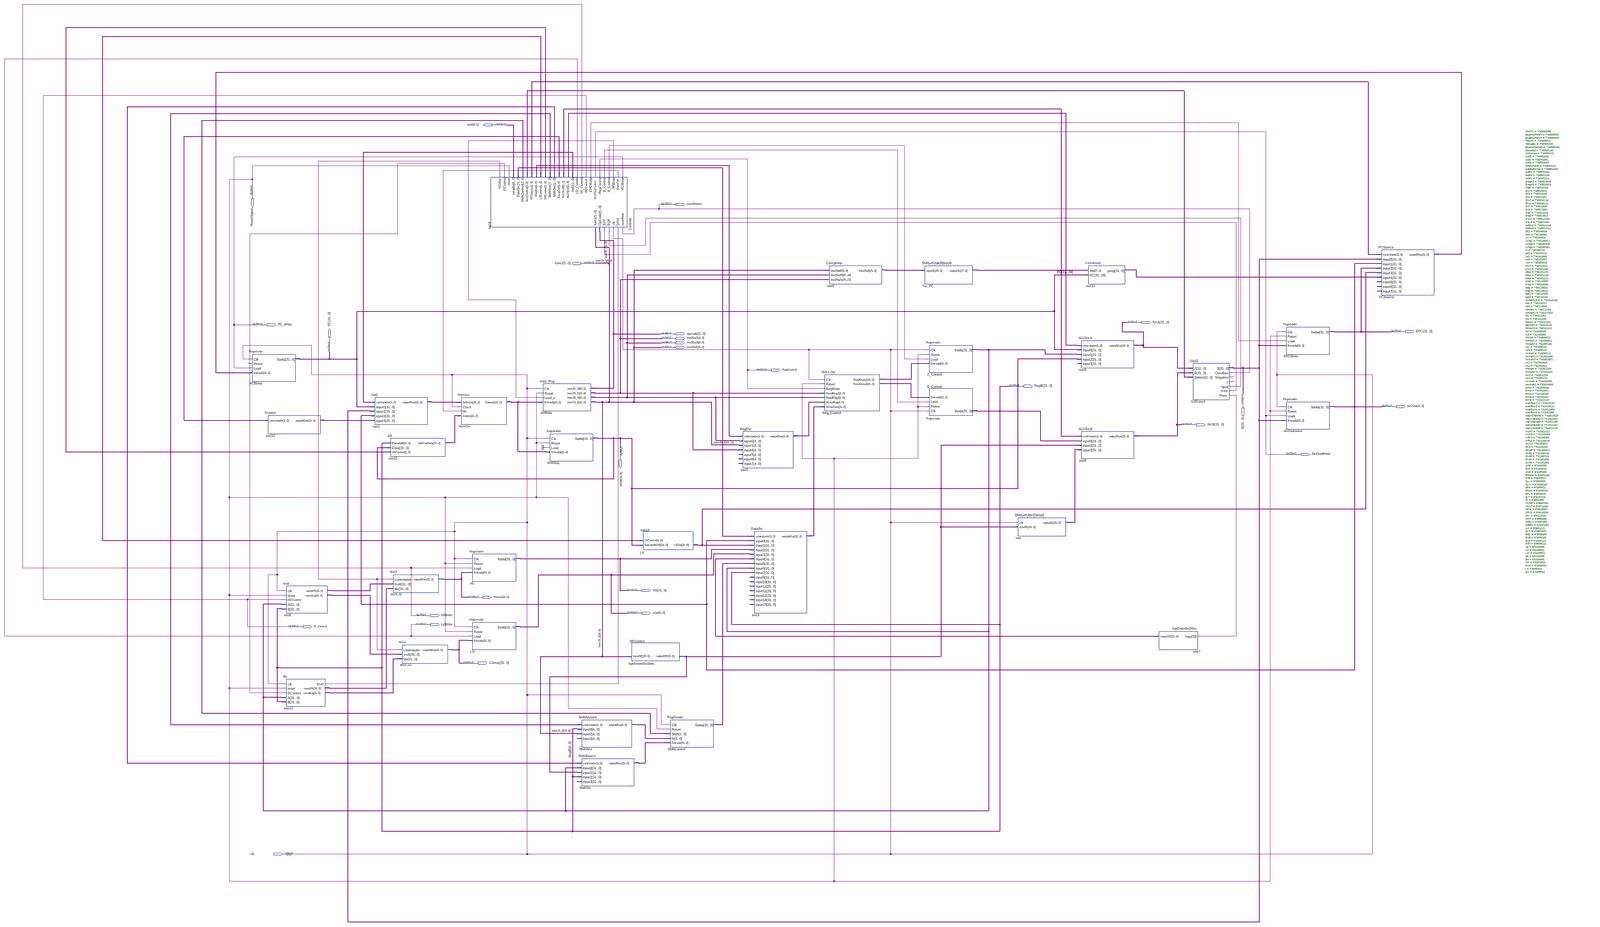
[diagram p0: schematic sheet, whole]
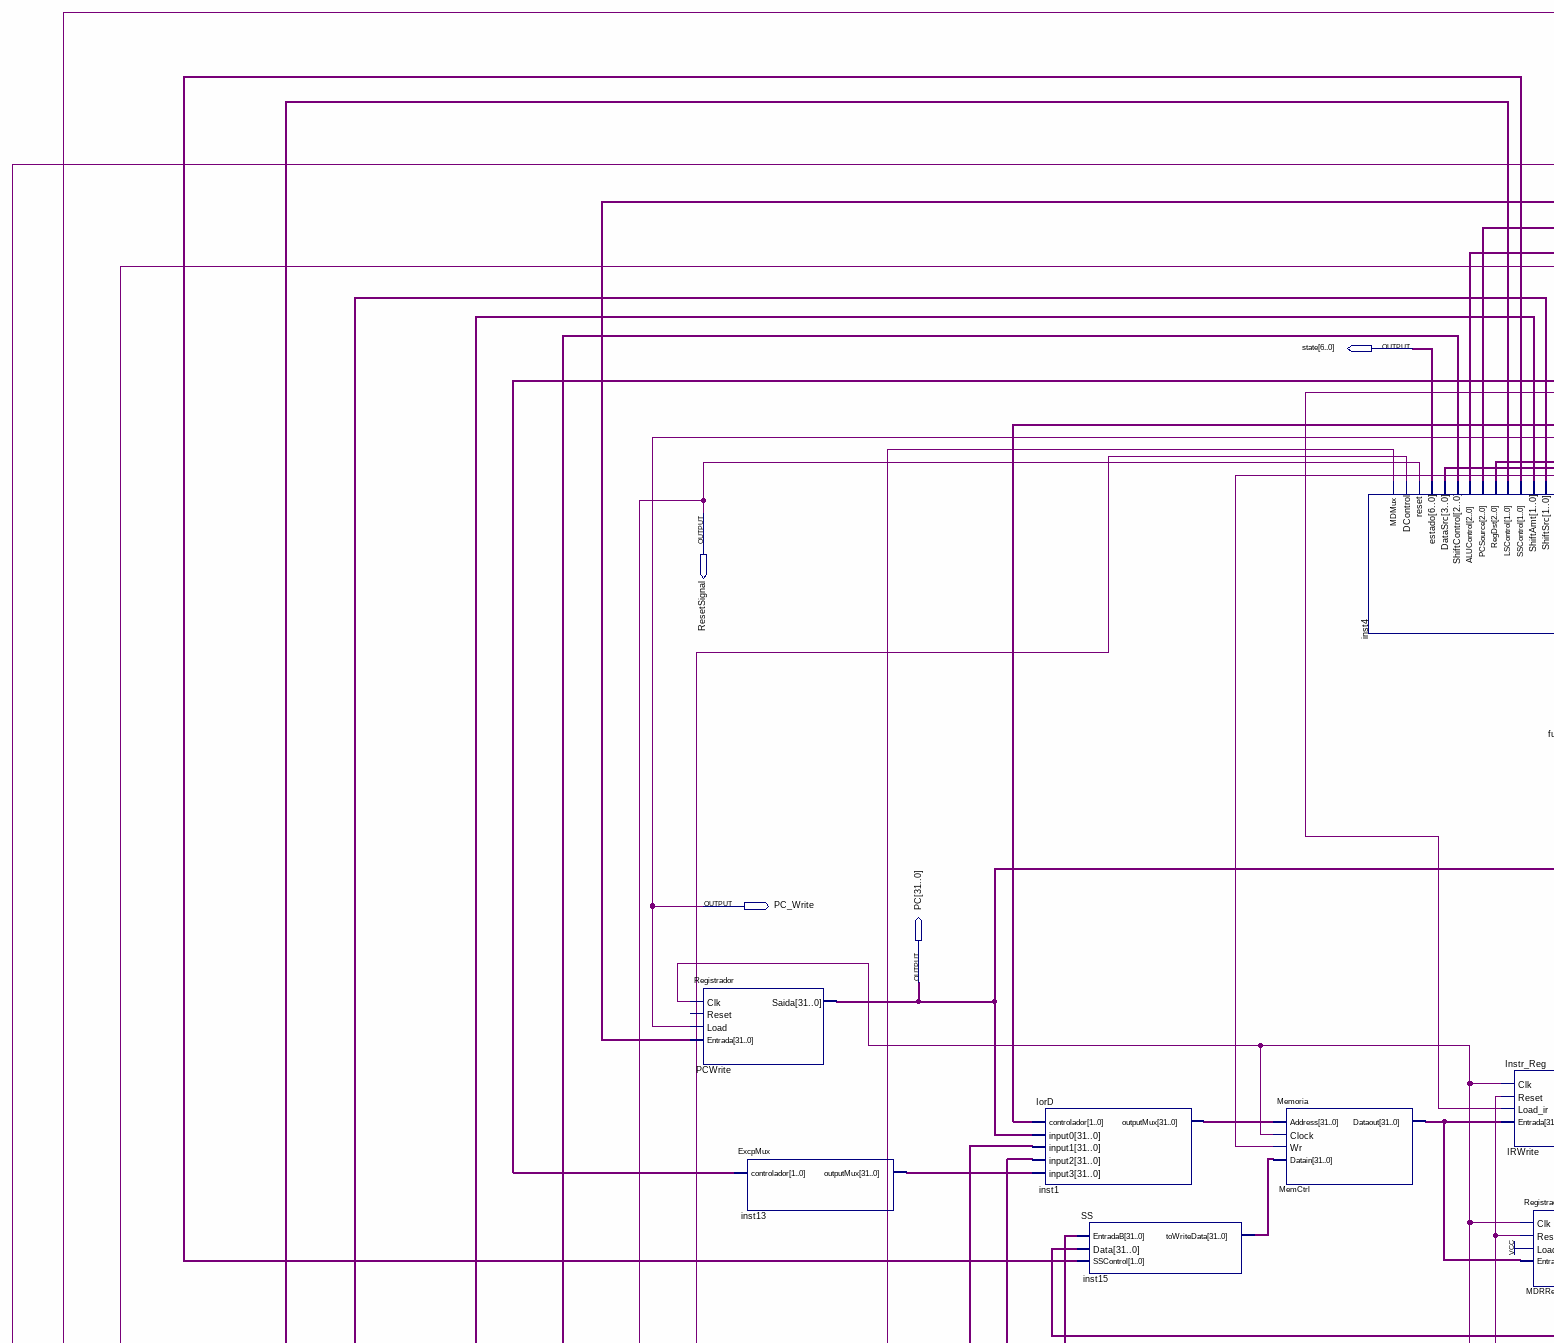
[diagram p1: schematic sheet, upper left part]
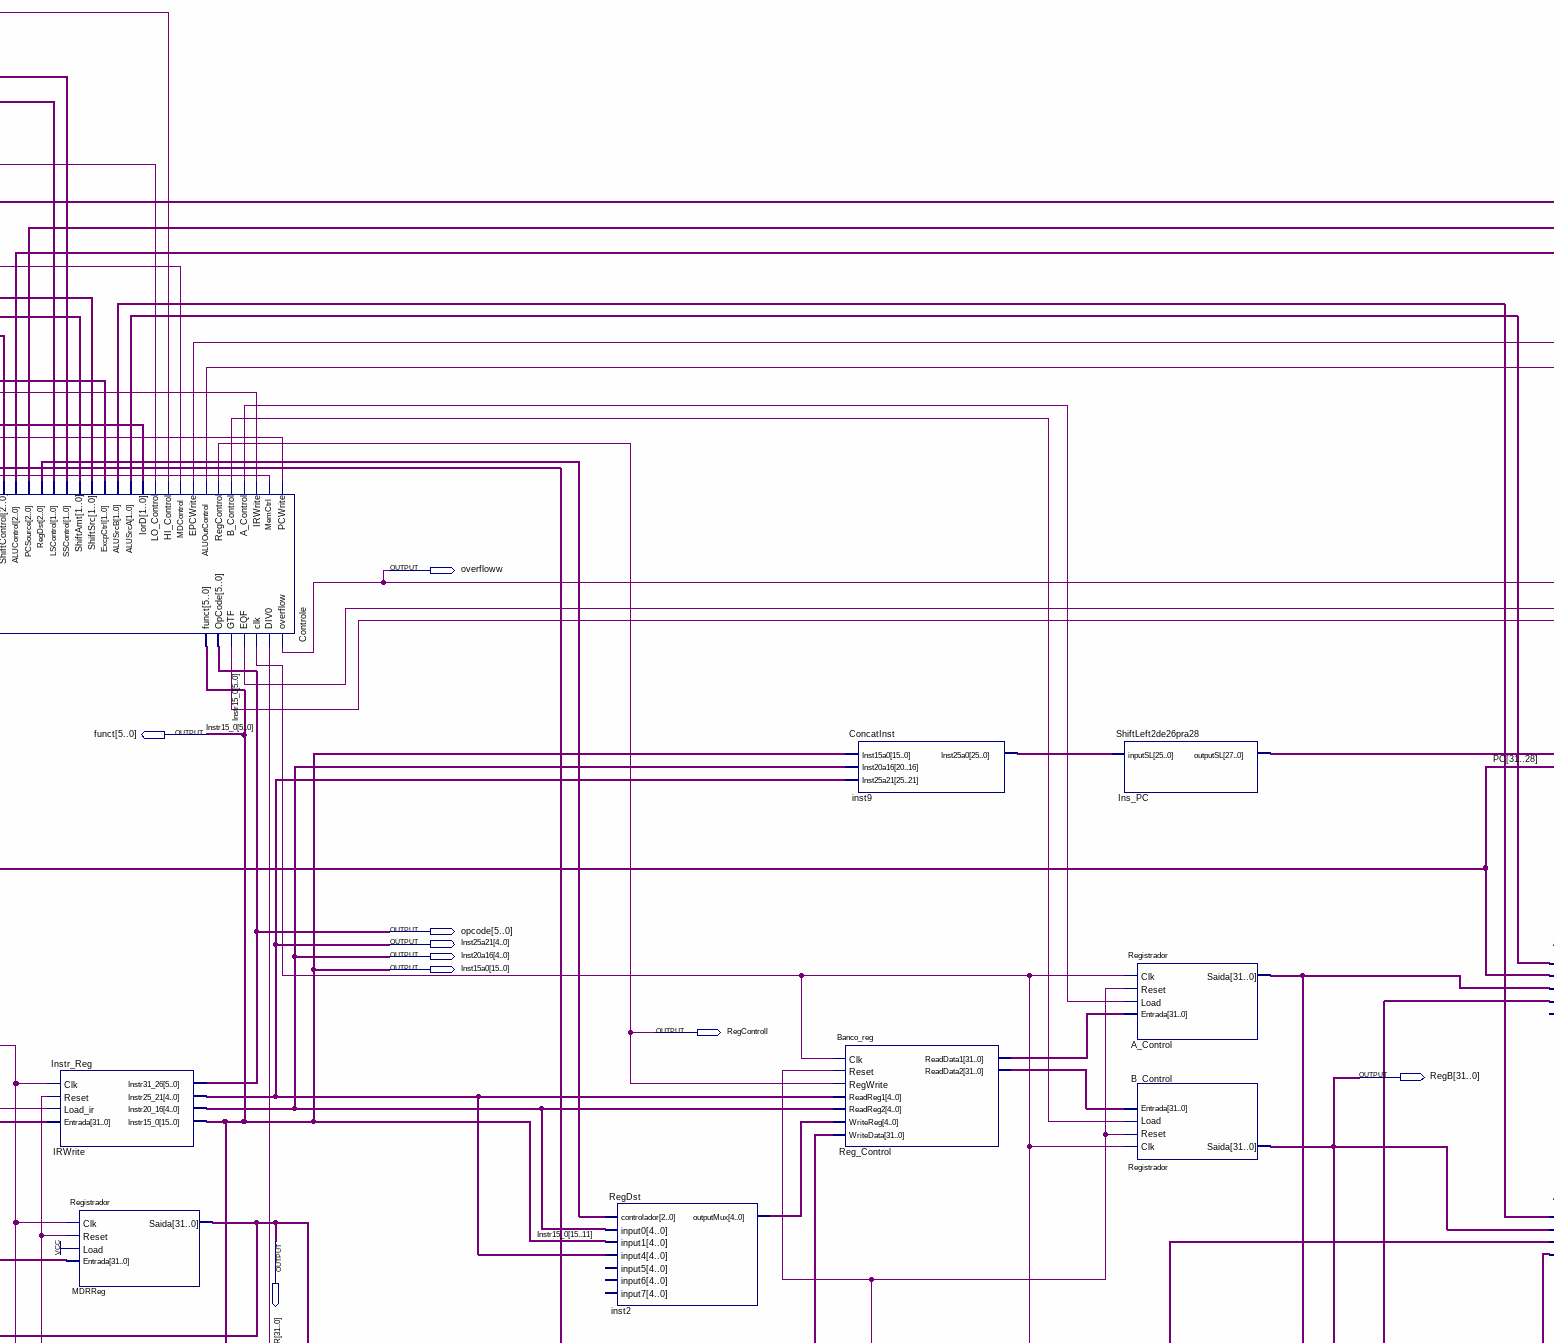
[diagram p2: schematic sheet, upper centre part]
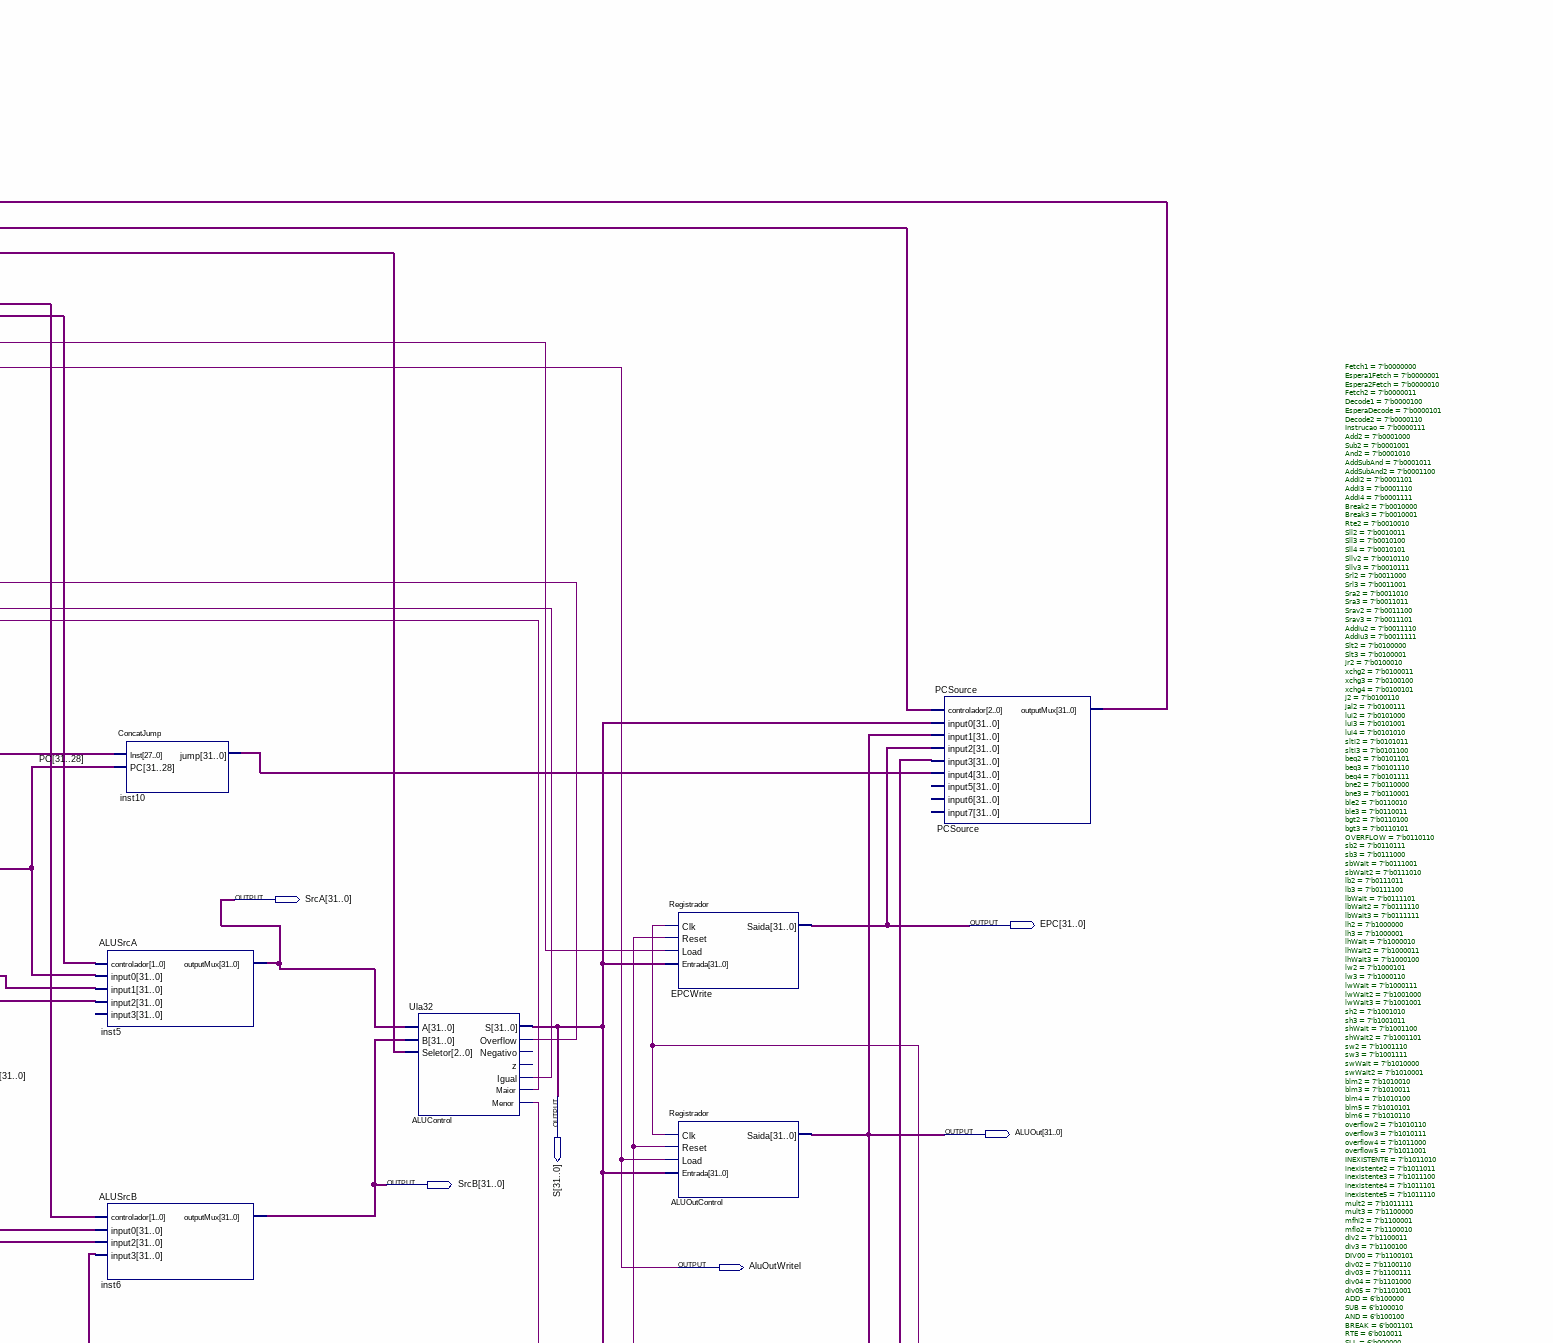
[diagram p3: schematic sheet, upper right part]
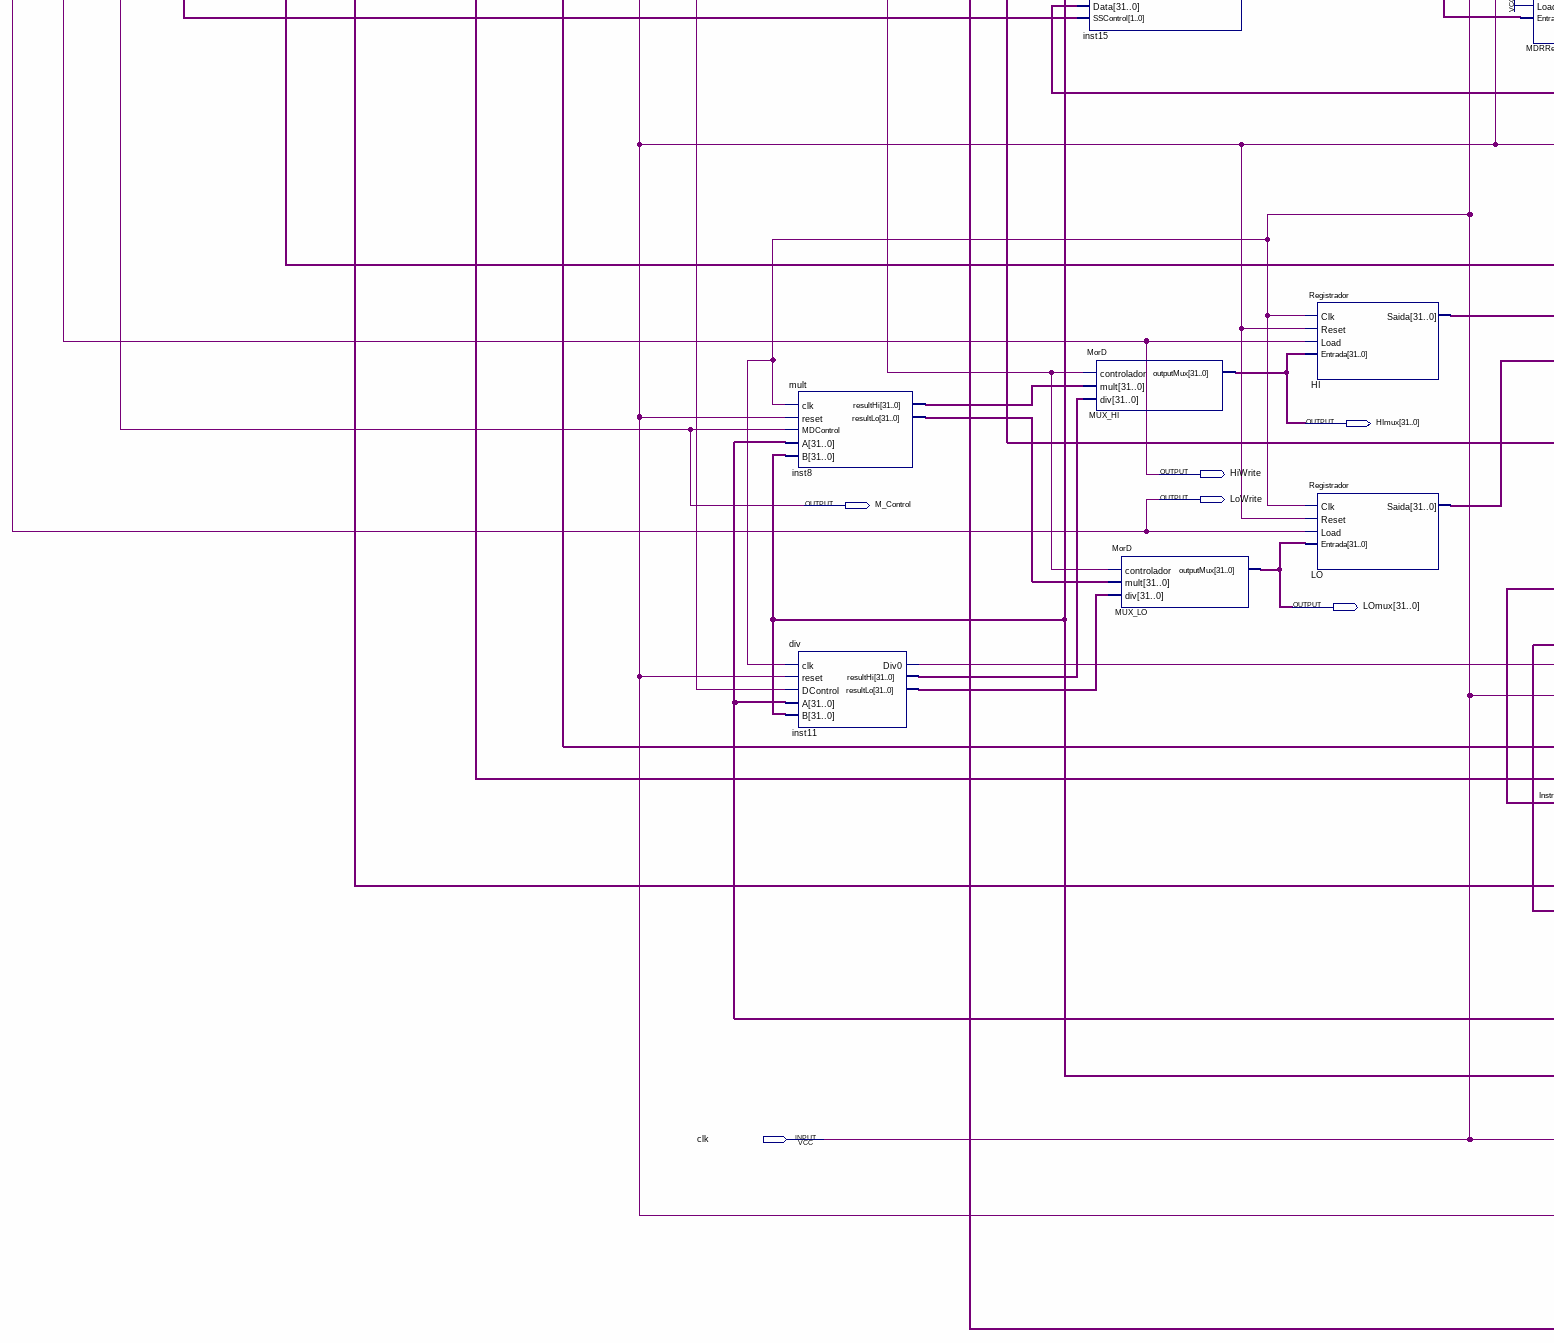
[diagram p4: schematic sheet, lower left part]
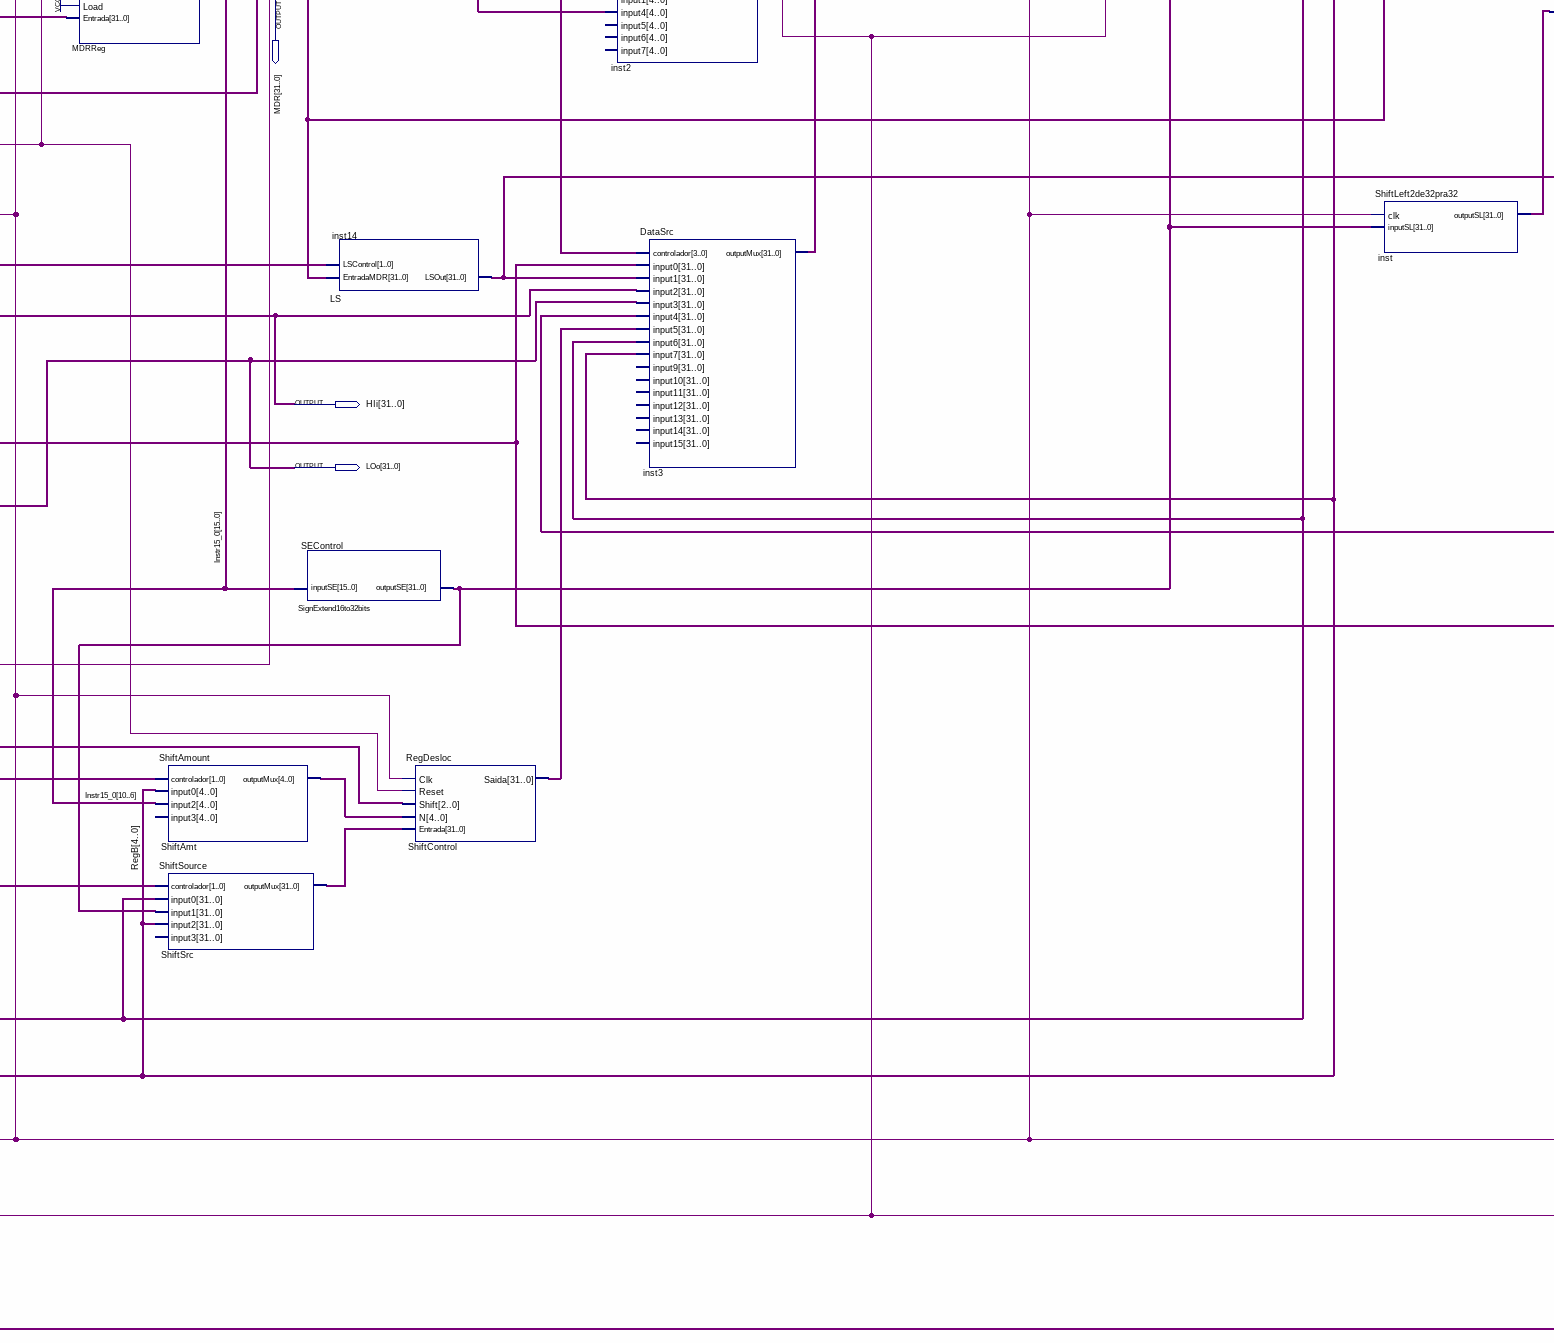
[diagram p5: schematic sheet, lower centre part]
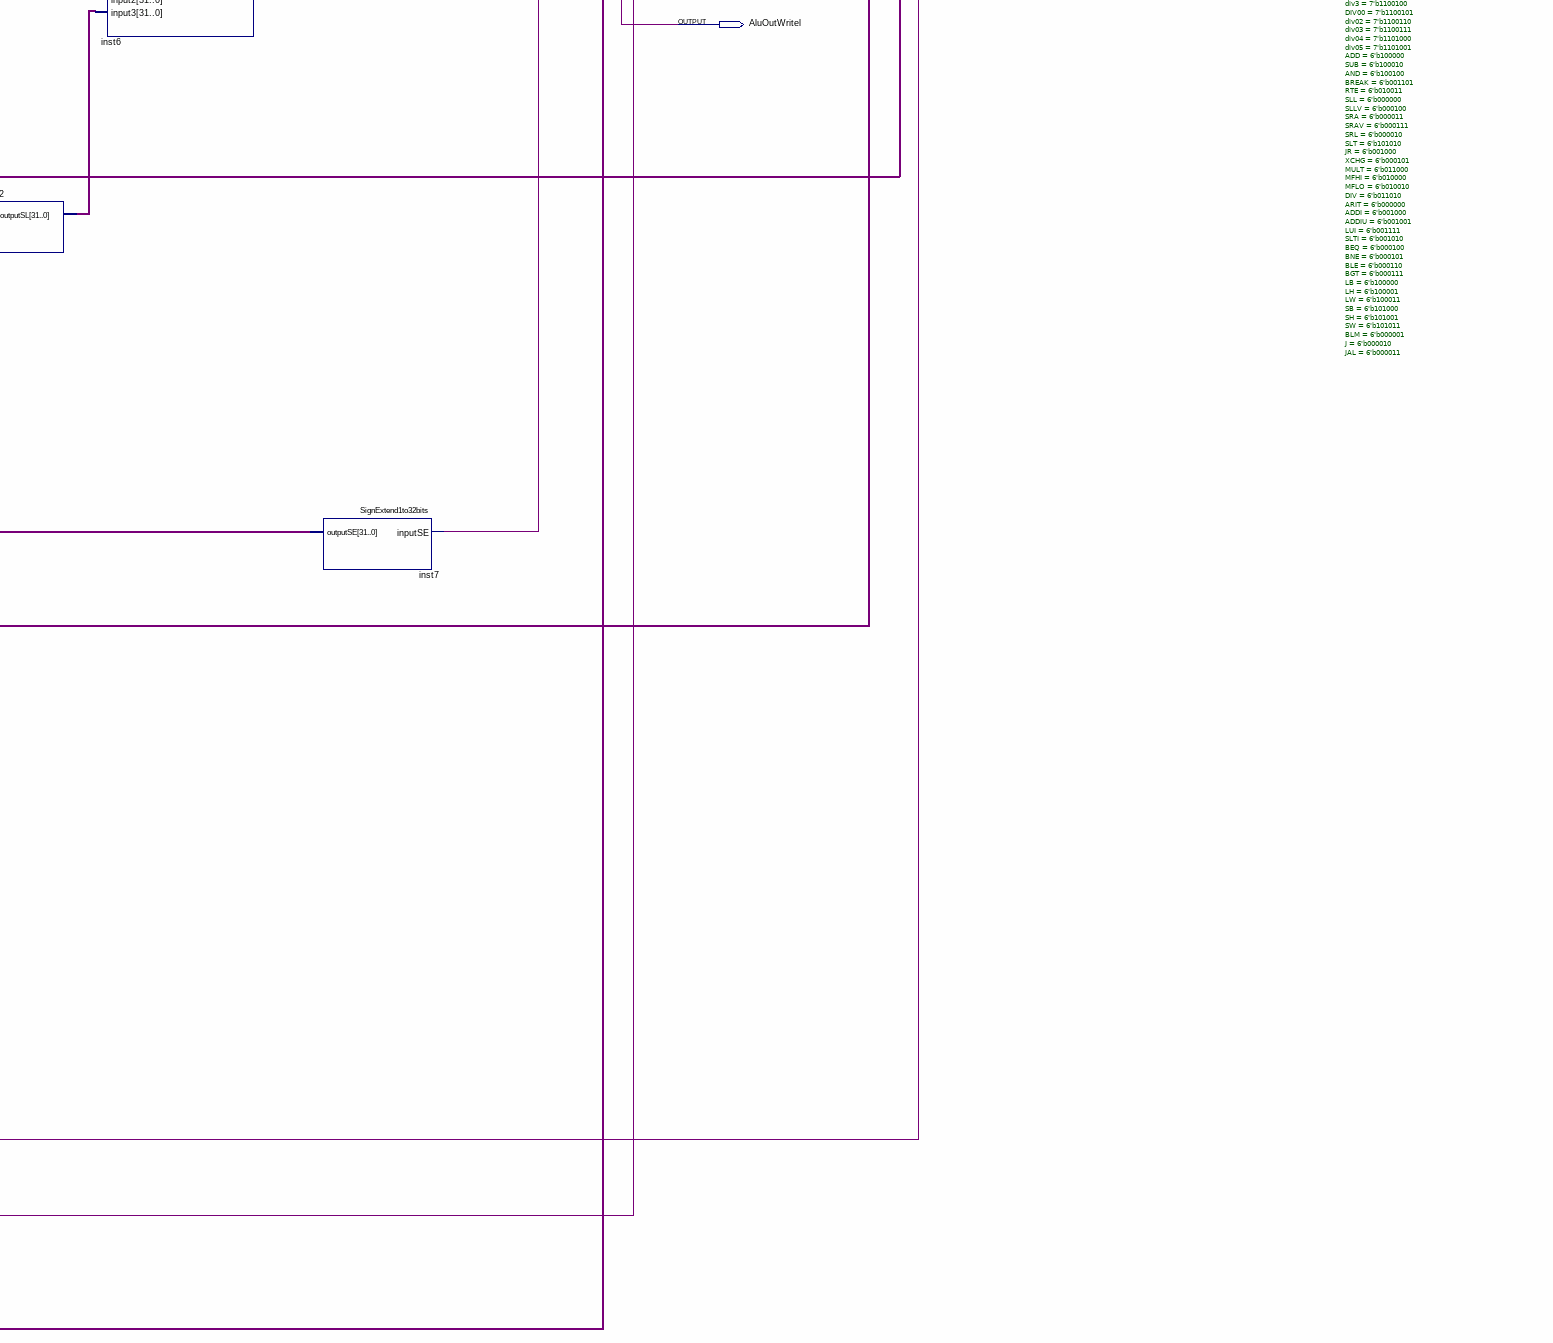
[diagram p6: schematic sheet, lower right part]
// Quartus schematic Hardware.bdf as structural Verilog: 35 symbols, 27 pins
module Hardware (
  input  clk,
  output [6:0] state,
  output ResetSignal,
  output overfloww,
  output [5:0] funct,
  output [31:0] SrcA,
  output PC_Write,
  output [31:0] EPC,
  output [5:0] opcode,
  output [4:0] Inst25a21,
  output [4:0] Inst20a16,
  output [15:0] Inst15a0,
  output [31:0] PC,
  output RegControll,
  output [31:0] RegB,
  output [31:0] S,
  output [31:0] ALUOut,
  output [31:0] SrcB,
  output [31:0] MDR,
  output AluOutWritel,
  output [31:0] HIi,
  output [31:0] HImux,
  output [31:0] LOo,
  output HiWrite,
  output LoWrite,
  output M_Control,
  output [31:0] LOmux
);

  wire ALUControl_igual, ALUControl_maior, ALUControl_menor, inst4_a_control, inst4_b_control,
       inst4_dcontrol, inst4_epcwrite, inst4_irwrite, inst4_mdmux, inst4_memctrl, inst11_div0;
  wire [1:0] inst4_alusrca, inst4_alusrcb, inst4_excpctrl, inst4_iord, inst4_lscontrol, inst4_shiftamt,
       inst4_shiftsrc, inst4_sscontrol;
  wire [2:0] inst4_alucontrol, inst4_pcsource, inst4_regdst, inst4_shiftcontrol;
  wire [3:0] inst4_datasrc;
  wire [4:0] inst2_outputmux, ShiftAmt_outputmux;
  wire [25:0] inst9_inst25a0;
  wire [27:0] Ins_PC_outputsl;
  wire [31:0] A_Control_saida, inst1_outputmux, inst3_outputmux, inst7_outputse, inst8_resulthi,
       inst8_resultlo, inst10_jump, inst11_resulthi, inst11_resultlo, inst13_outputmux, inst14_lsout,
       inst15_towritedata, inst_outputsl, MemCtrl_dataout, PCSource_outputmux, Reg_Control_readdata1,
       Reg_Control_readdata2, SEControl_outputse, ShiftControl_saida, ShiftSrc_outputmux;

  Registrador PCWrite (.Clk(clk), .Load(PC_Write), .Entrada(PCSource_outputmux), .Saida(PC));  // open: Reset
  ExcpMux inst13 (.controlador(inst4_excpctrl), .outputMux(inst13_outputmux));
  mult inst8 (
    .clk(clk), .reset(ResetSignal), .MDControl(M_Control), .A(A_Control_saida), .B(RegB),
    .resultHi(inst8_resulthi), .resultLo(inst8_resultlo));
  div inst11 (
    .clk(clk), .reset(ResetSignal), .DControl(inst4_dcontrol), .A(A_Control_saida), .B(RegB),
    .Div0(inst11_div0), .resultHi(inst11_resulthi), .resultLo(inst11_resultlo));
  IorD inst1 (
    .controlador(inst4_iord), .input0(PC), .input1(S), .input2(ALUOut), .input3(inst13_outputmux),
    .outputMux(inst1_outputmux));
  SS inst15 (.EntradaB(RegB), .Data(MDR), .SSControl(inst4_sscontrol), .toWriteData(inst15_towritedata));
  MorD MUX_HI (.controlador(inst4_mdmux), .mult(inst8_resulthi), .div(inst11_resulthi), .outputMux(HImux));
  MorD MUX_LO (.controlador(inst4_mdmux), .mult(inst8_resultlo), .div(inst11_resultlo), .outputMux(LOmux));
  Memoria MemCtrl (
    .Address(inst1_outputmux), .Clock(clk), .Wr(inst4_memctrl), .Datain(inst15_towritedata),
    .Dataout(MemCtrl_dataout));
  Registrador HI (.Clk(clk), .Reset(ResetSignal), .Load(HiWrite), .Entrada(HImux), .Saida(HIi));
  Registrador LO (.Clk(clk), .Reset(ResetSignal), .Load(LoWrite), .Entrada(LOmux), .Saida(LOo));
  Controle #(.Fetch1(7'b0000000), .Espera1Fetch(7'b0000001), .Espera2Fetch(7'b0000010), .Fetch2(7'b0000011), .Decode1(7'b0000100), .EsperaDecode(7'b0000101), .Decode2(7'b0000110), .Instrucao(7'b0000111), .Add2(7'b0001000), .Sub2(7'b0001001), .And2(7'b0001010), .AddSubAnd(7'b0001011), .AddSubAnd2(7'b0001100), .Addi2(7'b0001101), .Addi3(7'b0001110), .Addi4(7'b0001111), .Break2(7'b0010000), .Break3(7'b0010001), .Rte2(7'b0010010), .Sll2(7'b0010011), .Sll3(7'b0010100), .Sll4(7'b0010101), .Sllv2(7'b0010110), .Sllv3(7'b0010111), .Srl2(7'b0011000), .Srl3(7'b0011001), .Sra2(7'b0011010), .Sra3(7'b0011011), .Srav2(7'b0011100), .Srav3(7'b0011101), .Addiu2(7'b0011110), .Addiu3(7'b0011111), .Slt2(7'b0100000), .Slt3(7'b0100001), .jr2(7'b0100010), .xchg2(7'b0100011), .xchg3(7'b0100100), .xchg4(7'b0100101), .j2(7'b0100110), .jal2(7'b0100111), .lui2(7'b0101000), .lui3(7'b0101001), .lui4(7'b0101010), .slti2(7'b0101011), .slti3(7'b0101100), .beq2(7'b0101101), .beq3(7'b0101110), .beq4(7'b0101111), .bne2(7'b0110000), .bne3(7'b0110001), .ble2(7'b0110010), .ble3(7'b0110011), .bgt2(7'b0110100), .bgt3(7'b0110101), .OVERFLOW(7'b0110110), .sb2(7'b0110111), .sb3(7'b0111000), .sbWait(7'b0111001), .sbWait2(7'b0111010), .lb2(7'b0111011), .lb3(7'b0111100), .lbWait(7'b0111101), .lbWait2(7'b0111110), .lbWait3(7'b0111111), .lh2(7'b1000000), .lh3(7'b1000001), .lhWait(7'b1000010), .lhWait2(7'b1000011), .lhWait3(7'b1000100), .lw2(7'b1000101), .lw3(7'b1000110), .lwWait(7'b1000111), .lwWait2(7'b1001000), .lwWait3(7'b1001001), .sh2(7'b1001010), .sh3(7'b1001011), .shWait(7'b1001100), .shWait2(7'b1001101), .sw2(7'b1001110), .sw3(7'b1001111), .swWait(7'b1010000), .swWait2(7'b1010001), .blm2(7'b1010010), .blm3(7'b1010011), .blm4(7'b1010100), .blm5(7'b1010101), .blm6(7'b1010110), .overflow2(7'b1010110), .overflow3(7'b1010111), .overflow4(7'b1011000), .overflow5(7'b1011001), .INEXISTENTE(7'b1011010), .inexistente2(7'b1011011), .inexistente3(7'b1011100), .inexistente4(7'b1011101), .inexistente5(7'b1011110), .mult2(7'b1011111), .mult3(7'b1100000), .mfhi2(7'b1100001), .mflo2(7'b1100010), .div2(7'b1100011), .div3(7'b1100100), .DIV00(7'b1100101), .div02(7'b1100110), .div03(7'b1100111), .div04(7'b1101000), .div05(7'b1101001), .ADD(6'b100000), .SUB(6'b100010), .AND(6'b100100), .BREAK(6'b001101), .RTE(6'b010011), .SLL(6'b000000), .SLLV(6'b000100), .SRA(6'b000011), .SRAV(6'b000111), .SRL(6'b000010), .SLT(6'b101010), .JR(6'b001000), .XCHG(6'b000101), .MULT(6'b011000), .MFHI(6'b010000), .MFLO(6'b010010), .DIV(6'b011010), .ARIT(6'b000000), .ADDI(6'b001000), .ADDIU(6'b001001), .LUI(6'b001111), .SLTI(6'b001010), .BEQ(6'b000100), .BNE(6'b000101), .BLE(6'b000110), .BGT(6'b000111), .LB(6'b100000), .LH(6'b100001), .LW(6'b100011), .SB(6'b101000), .SH(6'b101001), .SW(6'b101011), .BLM(6'b000001), .J(6'b000010), .JAL(6'b000011)) inst4 (
    .overflow(overfloww), .DIV0(inst11_div0), .clk(clk), .EQF(ALUControl_igual), .GTF(ALUControl_maior),
    .OpCode(opcode), .funct(funct), .PCWrite(PC_Write), .MemCtrl(inst4_memctrl), .IRWrite(inst4_irwrite),
    .A_Control(inst4_a_control), .B_Control(inst4_b_control), .RegControl(RegControll),
    .ALUOutControl(AluOutWritel), .EPCWrite(inst4_epcwrite), .MDControl(M_Control), .HI_Control(HiWrite),
    .LO_Control(LoWrite), .IorD(inst4_iord), .ALUSrcA(inst4_alusrca), .ALUSrcB(inst4_alusrcb),
    .ExcpCtrl(inst4_excpctrl), .ShiftSrc(inst4_shiftsrc), .ShiftAmt(inst4_shiftamt),
    .SSControl(inst4_sscontrol), .LSControl(inst4_lscontrol), .RegDst(inst4_regdst),
    .PCSource(inst4_pcsource), .ALUControl(inst4_alucontrol), .ShiftControl(inst4_shiftcontrol),
    .DataSrc(inst4_datasrc), .estado(state), .reset(ResetSignal), .DControl(inst4_dcontrol),
    .MDMux(inst4_mdmux));
  Instr_Reg IRWrite (
    .Clk(clk), .Reset(ResetSignal), .Load_ir(inst4_irwrite), .Entrada(MemCtrl_dataout), .Instr31_26(opcode),
    .Instr25_21(Inst25a21), .Instr20_16(Inst20a16), .Instr15_0({Inst15a0[15:6], funct}));
  Registrador MDRReg (.Clk(clk), .Reset(ResetSignal), .Load(1'b1), .Entrada(MemCtrl_dataout), .Saida(MDR));
  ShiftAmount ShiftAmt (
    .controlador(inst4_shiftamt), .input0(RegB[4:0]), .input2(Inst15a0[10:6]), .outputMux(ShiftAmt_outputmux));  // open: input3
  ShiftSource ShiftSrc (
    .controlador(inst4_shiftsrc), .input0(A_Control_saida), .input1(SEControl_outputse), .input2(RegB),
    .outputMux(ShiftSrc_outputmux));  // open: input3
  LS inst14 (.EntradaMDR(MDR), .LSControl(inst4_lscontrol), .LSOut(inst14_lsout));
  SignExtend16to32bits SEControl (.inputSE({Inst15a0[15:6], funct}), .outputSE(SEControl_outputse));
  RegDesloc ShiftControl (
    .Clk(clk), .Reset(ResetSignal), .Shift(inst4_shiftcontrol), .N(ShiftAmt_outputmux),
    .Entrada(ShiftSrc_outputmux), .Saida(ShiftControl_saida));
  RegDst inst2 (
    .controlador(inst4_regdst), .input0(Inst20a16), .input1(Inst15a0[15:11]), .input4(Inst25a21),
    .outputMux(inst2_outputmux));  // open: input5, input6, input7
  DataSrc inst3 (
    .controlador(inst4_datasrc), .input0(ALUOut), .input1(inst14_lsout), .input2(HIi), .input3(LOo),
    .input4(inst7_outputse), .input5(ShiftControl_saida), .input6(A_Control_saida), .input7(RegB),
    .outputMux(inst3_outputmux));  // open: input9, input10, input11, input12, input13, input14, input15
  Banco_reg Reg_Control (
    .Clk(clk), .Reset(ResetSignal), .RegWrite(RegControll), .ReadReg1(Inst25a21), .ReadReg2(Inst20a16),
    .WriteReg(inst2_outputmux), .WriteData(inst3_outputmux), .ReadData1(Reg_Control_readdata1),
    .ReadData2(Reg_Control_readdata2));
  ConcatInst inst9 (
    .Inst15a0({Inst15a0[15:6], funct}), .Inst20a16(Inst20a16), .Inst25a21(Inst25a21),
    .Inst25a0(inst9_inst25a0));
  ShiftLeft2de26pra28 Ins_PC (.inputSL(inst9_inst25a0), .outputSL(Ins_PC_outputsl));
  Registrador A_Control (
    .Clk(clk), .Reset(ResetSignal), .Load(inst4_a_control), .Entrada(Reg_Control_readdata1),
    .Saida(A_Control_saida));
  Registrador B_Control (
    .Clk(clk), .Reset(ResetSignal), .Load(inst4_b_control), .Entrada(Reg_Control_readdata2), .Saida(RegB));
  ShiftLeft2de32pra32 inst (.clk(clk), .inputSL(SEControl_outputse), .outputSL(inst_outputsl));
  ConcatJump inst10 (.Inst(Ins_PC_outputsl), .PC(PC[31:28]), .jump(inst10_jump));
  ALUSrcA inst5 (
    .controlador(inst4_alusrca), .input0(PC), .input1(A_Control_saida), .input2(MDR), .outputMux(SrcA));  // open: input3
  ALUSrcB inst6 (
    .controlador(inst4_alusrcb), .input0(RegB), .input2(SEControl_outputse), .input3(inst_outputsl),
    .outputMux(SrcB));
  SignExtend1to32bits inst7 (.inputSE(ALUControl_menor), .outputSE(inst7_outputse));
  Ula32 ALUControl (
    .A(SrcA), .B(SrcB), .Seletor(inst4_alucontrol), .S(S), .Overflow(overfloww), .Igual(ALUControl_igual),
    .Maior(ALUControl_maior), .Menor(ALUControl_menor));  // open: Negativo, z
  Registrador EPCWrite (.Clk(clk), .Reset(ResetSignal), .Load(inst4_epcwrite), .Entrada(S), .Saida(EPC));
  Registrador ALUOutControl (.Clk(clk), .Reset(ResetSignal), .Load(AluOutWritel), .Entrada(S), .Saida(ALUOut));
  PCSource PCSource (
    .controlador(inst4_pcsource), .input0(S), .input1(ALUOut), .input2(EPC), .input3(inst14_lsout),
    .input4(inst10_jump), .outputMux(PCSource_outputmux));  // open: input5, input6, input7

  assign Inst15a0[5:0] = funct;

  // Other names for the same wires on the sheet: Instr15_0[15:0] = {Inst15a0[15:6], funct}
endmodule
